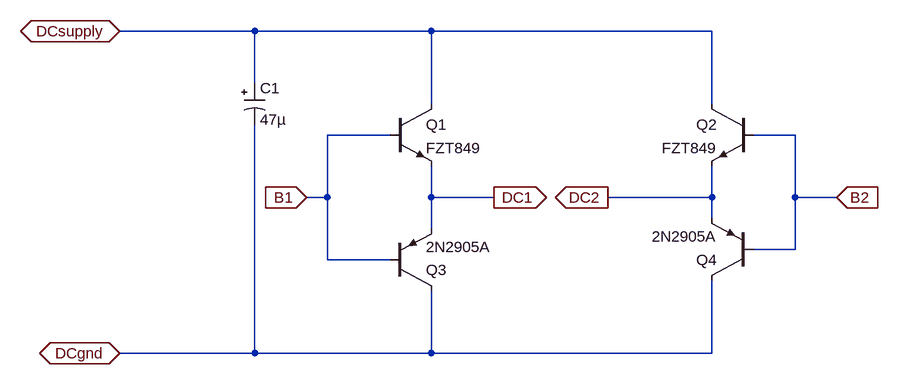
[diagram p0: schematic Motor_Model.asc]
Motor_Model.asc, the LTspice schematic file:
Version 4
SHEET 1 1068 680
WIRE 80 80 -128 80
WIRE 352 80 80 80
WIRE 784 80 352 80
WIRE 80 160 80 80
WIRE 352 192 352 80
WIRE 784 192 784 80
WIRE 288 240 192 240
WIRE 912 240 848 240
WIRE 192 336 192 240
WIRE 192 336 160 336
WIRE 352 336 352 288
WIRE 448 336 352 336
WIRE 784 336 784 288
WIRE 784 336 624 336
WIRE 912 336 912 240
WIRE 976 336 912 336
WIRE 784 368 784 336
WIRE 352 384 352 336
WIRE 912 416 912 336
WIRE 912 416 848 416
WIRE 192 432 192 336
WIRE 288 432 192 432
WIRE 80 576 80 224
WIRE 80 576 -128 576
WIRE 352 576 352 480
WIRE 352 576 80 576
WIRE 784 576 784 464
WIRE 784 576 352 576
FLAG 160 336 B1
IOPIN 160 336 In
FLAG 448 336 DC1
IOPIN 448 336 Out
FLAG 624 336 DC2
IOPIN 624 336 Out
FLAG 976 336 B2
IOPIN 976 336 In
FLAG -128 80 DCsupply
IOPIN -128 80 BiDir
FLAG -128 576 DCgnd
IOPIN -128 576 BiDir
SYMBOL polcap 64 160 R0
SYMATTR InstName C1
SYMATTR Value 47µ
SYMBOL npn 288 192 R0
SYMATTR InstName Q1
SYMATTR Value FZT849
SYMBOL pnp 288 480 M180
SYMATTR InstName Q3
SYMATTR Value 2N2905A
SYMBOL npn 848 192 M0
SYMATTR InstName Q2
SYMATTR Value FZT849
SYMBOL pnp 848 464 R180
SYMATTR InstName Q4
SYMATTR Value 2N2905A

The netlist it stands for:
* Motor_Model.asc
C1 DCsupply DCgnd 47µ
Q1 DCsupply B1 DC1 0 FZT849
Q3 DCgnd B1 DC1 0 2N2905A
Q2 DCsupply B2 DC2 0 FZT849
Q4 DCgnd B2 DC2 0 2N2905A
.model NPN NPN
.model PNP PNP
.lib standard.bjt
.backanno
.end